# EAGLE design PCB-full (EAGLE 6.5.0)
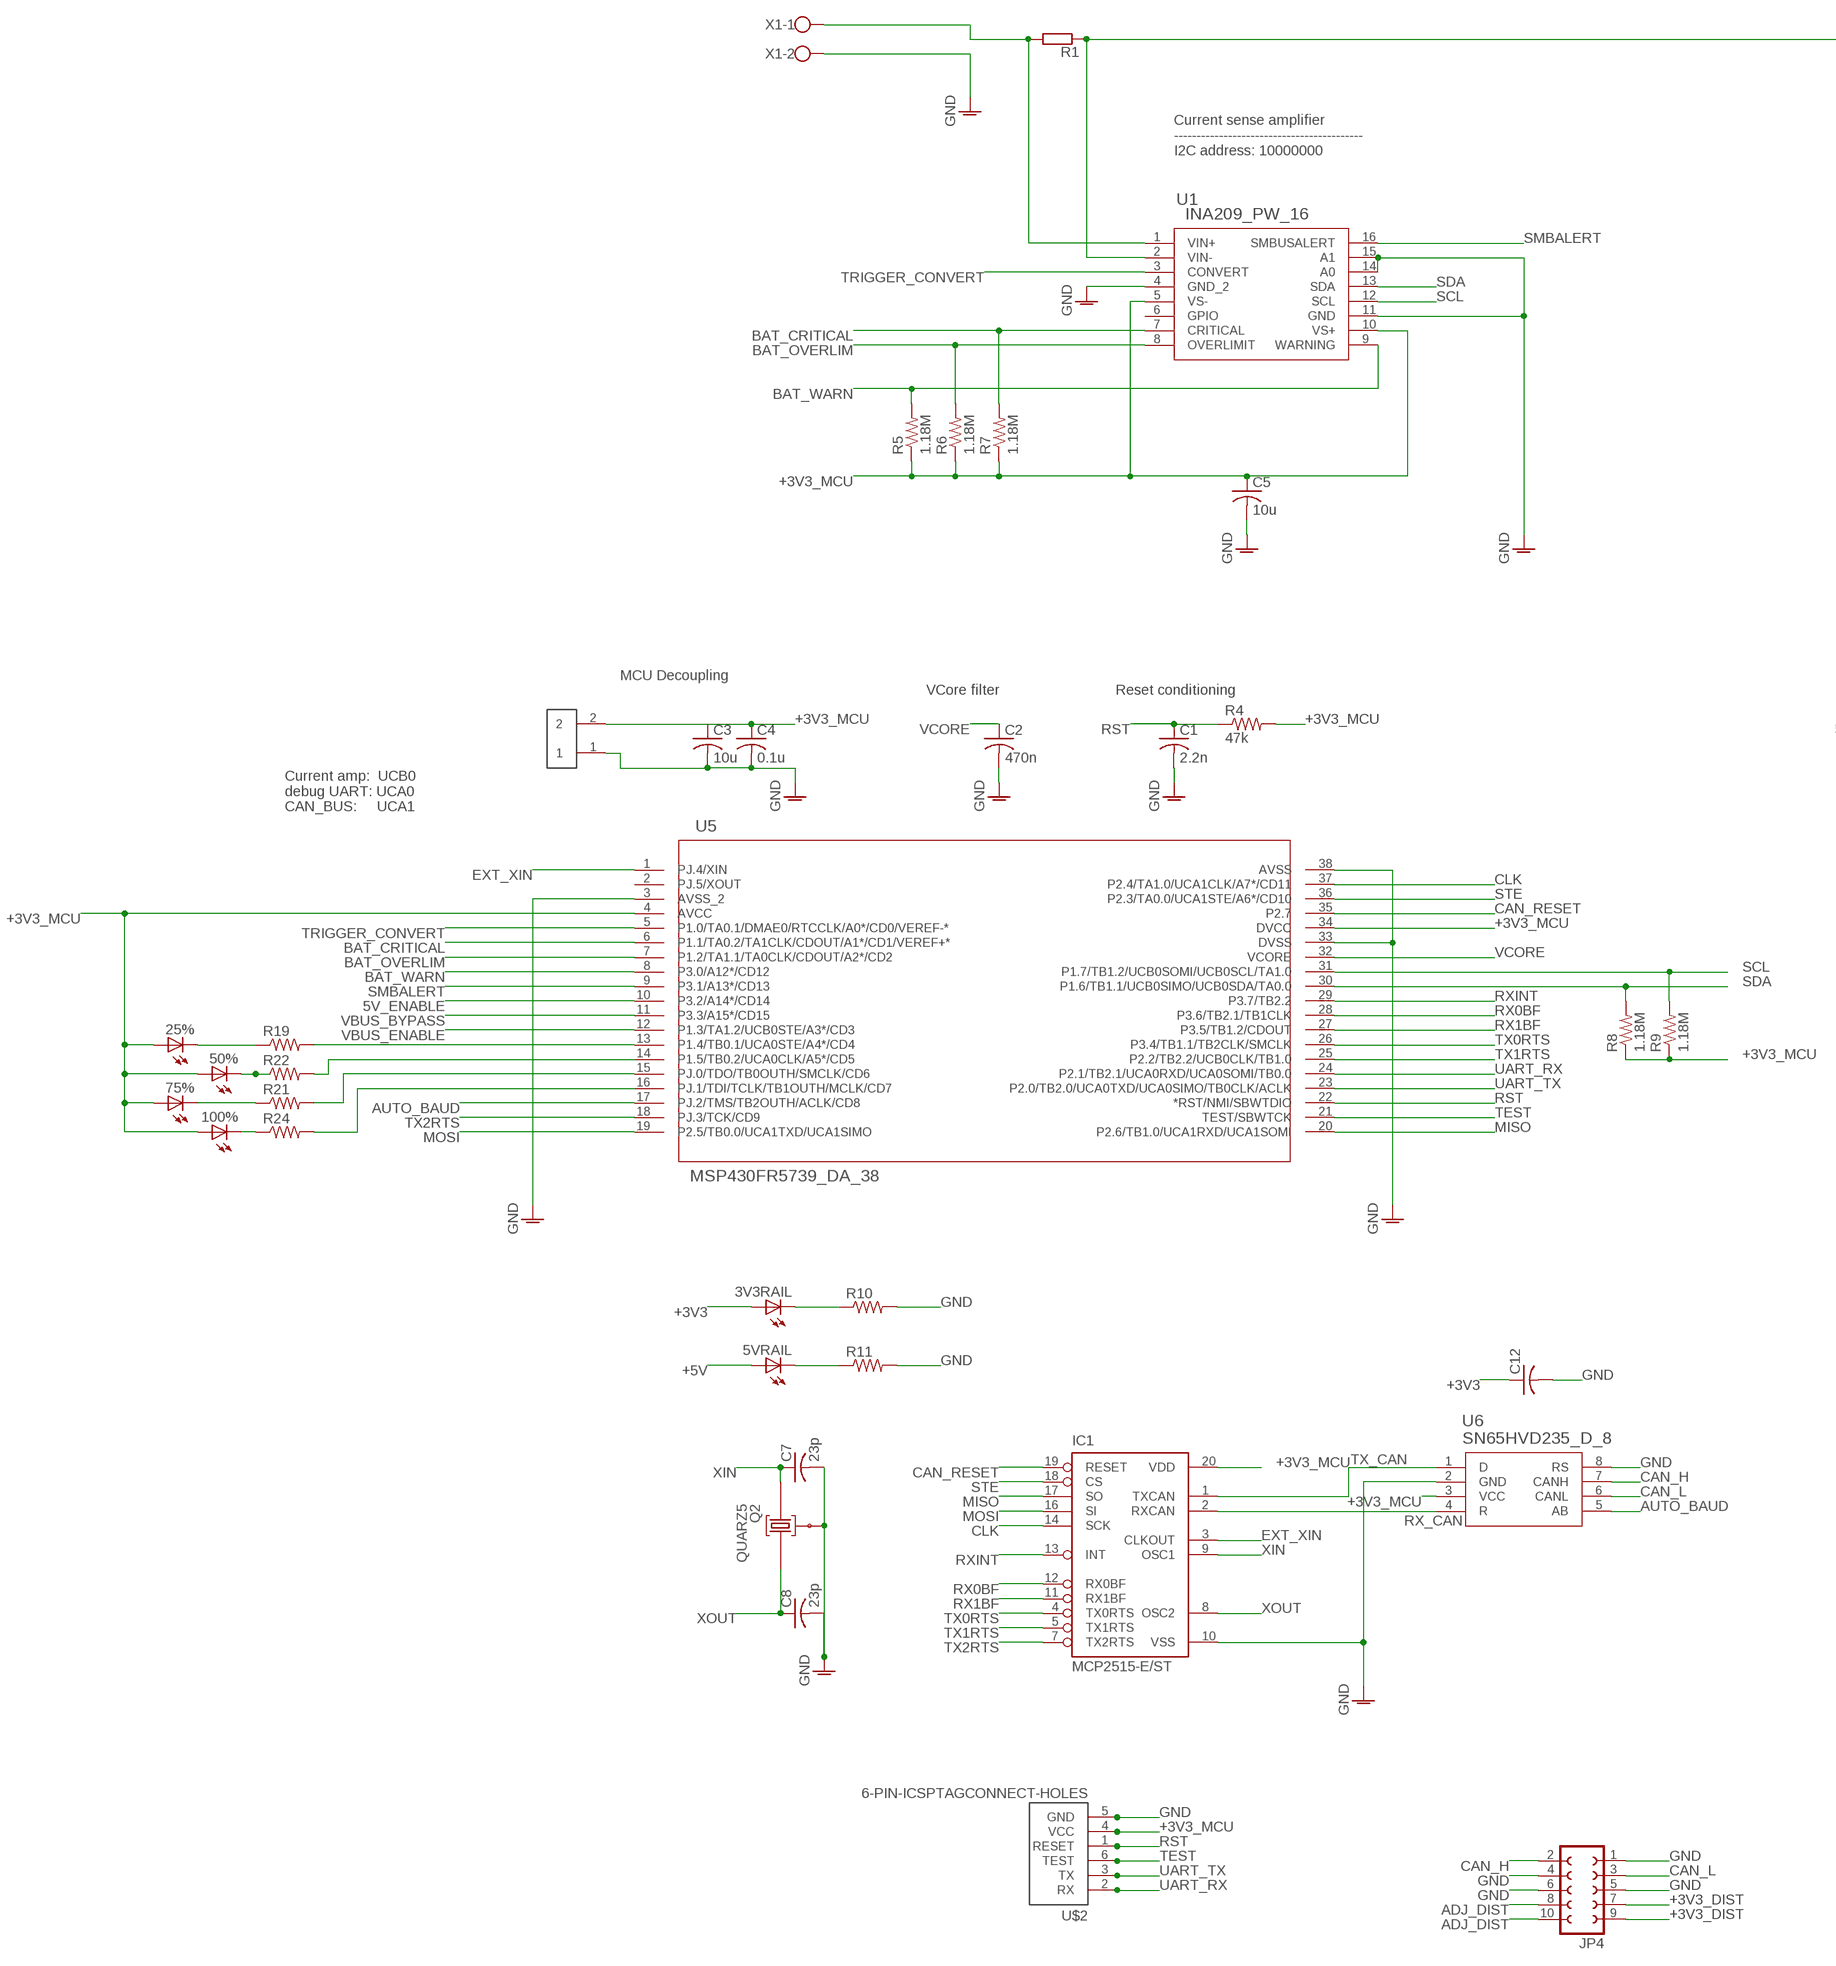
[diagram p0: schematic, sheet 1, part 1 of 2]
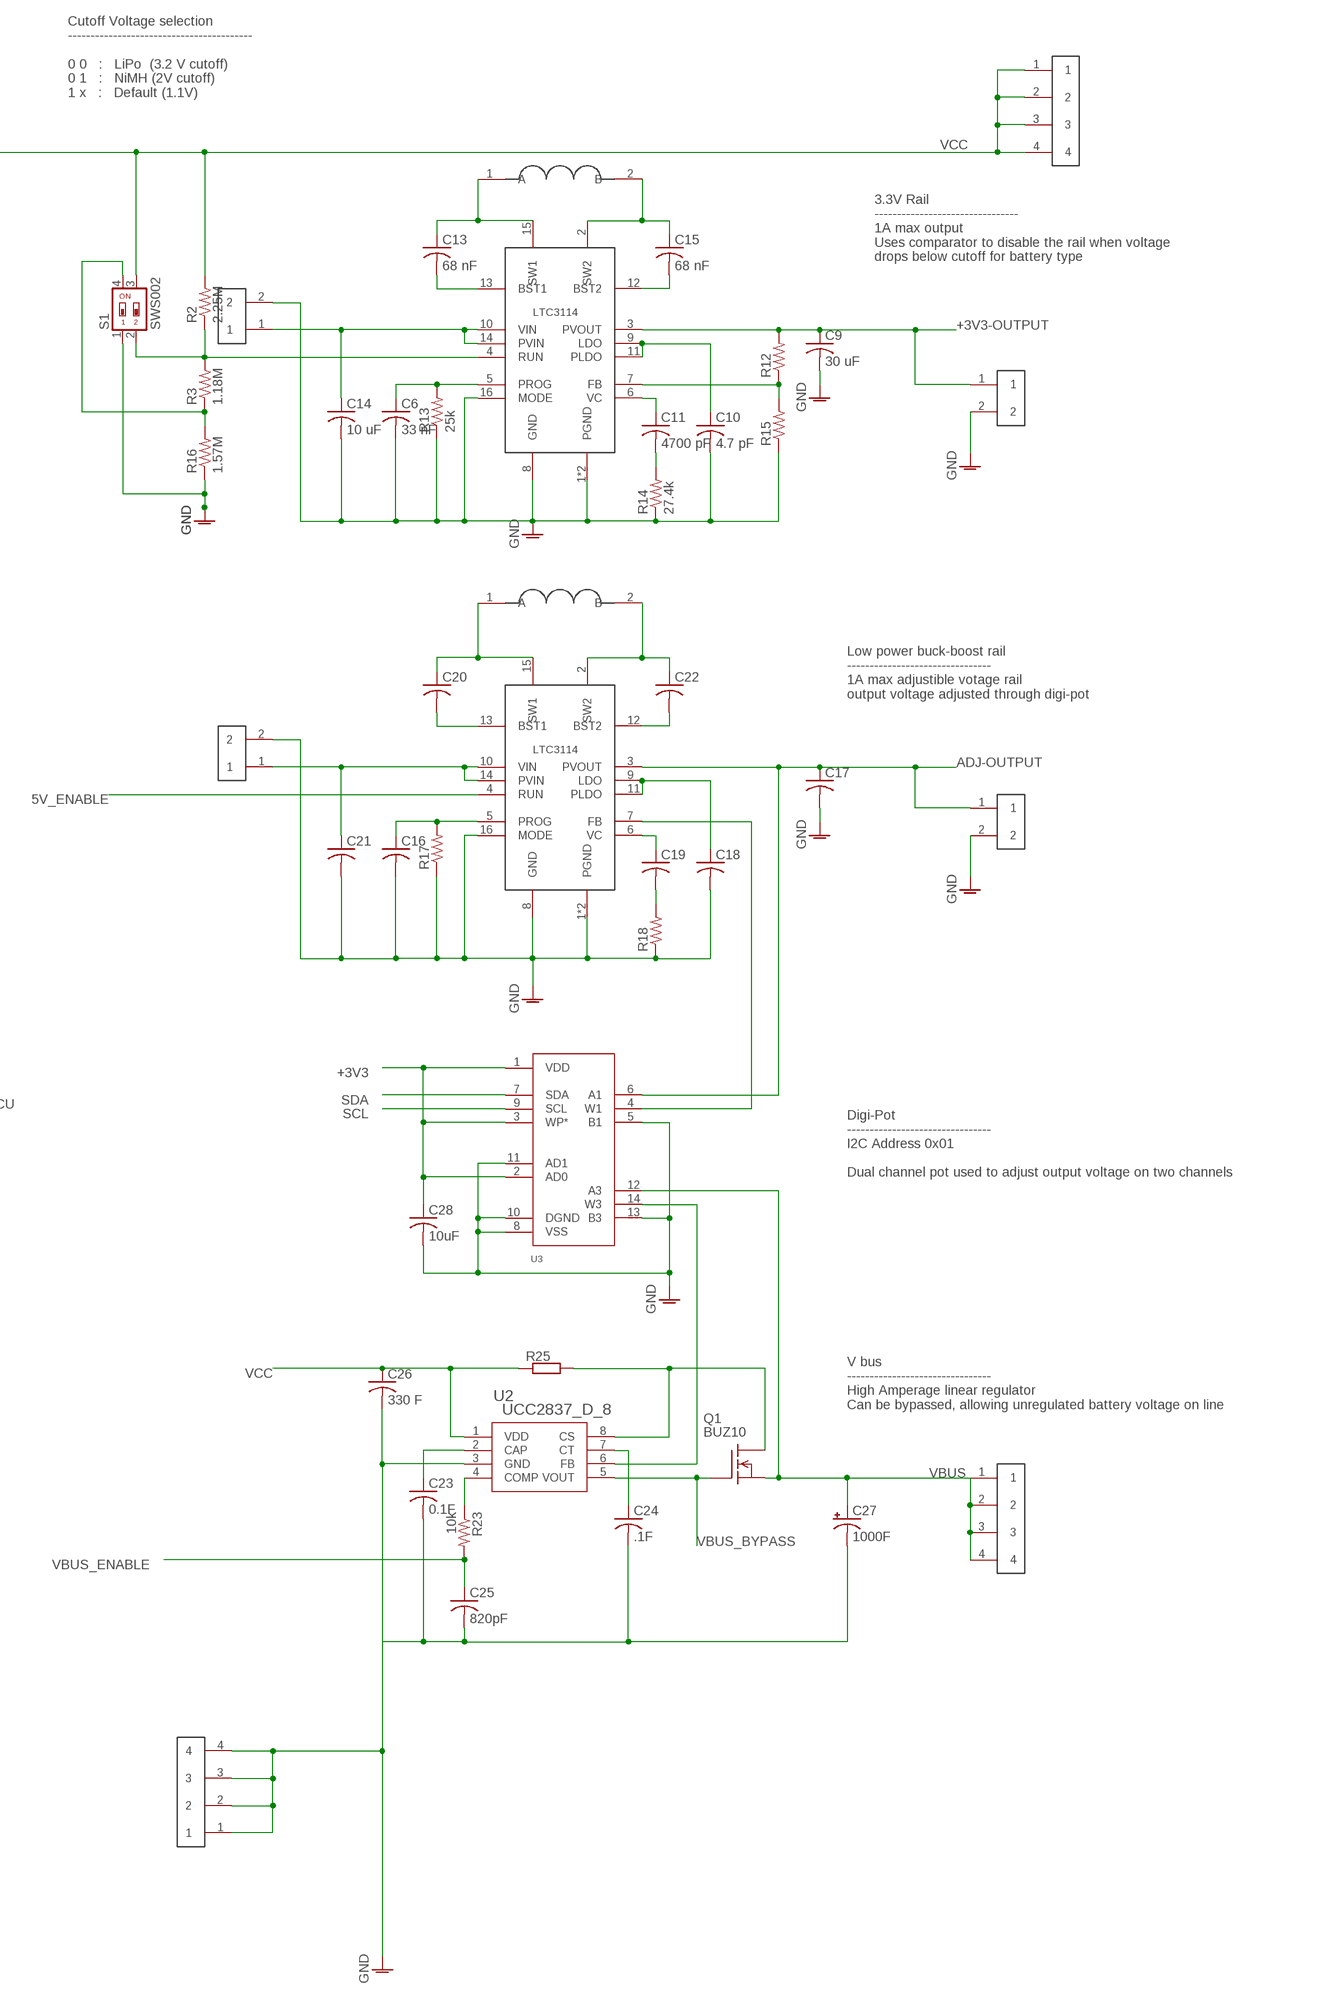
[diagram p1: schematic, sheet 1, part 2 of 2]

## Parts
3V3RAIL  LEDCHIP-LED0603  [CHIP-LED0603]
5VRAIL  LEDCHIP-LED0603  [CHIP-LED0603]
25%  LEDCHIP-LED0603  [CHIP-LED0603]
50%  LEDCHIP-LED0603  [CHIP-LED0603]
75%  LEDCHIP-LED0603  [CHIP-LED0603]
100%  LEDCHIP-LED0603  [CHIP-LED0603]
C1  2.2n  C-USC1206  [C1206]
C2  470n  C-USC1206  [C1206]
C3  10u  C-USC1206  [C1206]
C4  0.1u  C-USC1206  [C1206]
C5  10u  C-USC1206  [C1206]
C6  33 nF  C-USC0805  [C0805]
C7  23p  C-USC1206  [C1206]
C8  23p  C-USC1206  [C1206]
C9  30 uF  C-USC0805  [C0805]
C10  4.7 pF  C-USC0805  [C0805]
C11  4700 pF  C-USC0805  [C0805]
C12  C-USC0603  [C0603]
C13  68 nF  C-USC0805  [C0805]
C14  10 uF  C-USC0805  [C0805]
C15  68 nF  C-USC0805  [C0805]
C16  C-USC0805  [C0805]
C17  C-USC0805  [C0805]
C18  C-USC0805  [C0805]
C19  C-USC0805  [C0805]
C20  C-USC0805  [C0805]
C21  C-USC0805  [C0805]
C22  C-USC0805  [C0805]
C23  0.1F  C-USC0805  [C0805]
C24  .1F  C-USC0805  [C0805]
C25  820pF  C-USC0805  [C0805]
C26  330 F  C-USC0805  [C0805]
C27  1000F  CPOL-USTAP5-60  [TAP5-60]
C28  10uF  C-USC0603  [C0603]
IC1  MCP2515-E/ST  [TSSOP20]
JP4  FE05-2  [FE05-2]
Q1  BUZ10  [TO220]
Q2  QUARZ5  [QUARZ5]
R1  SMR  [SMR]
R2  2.25M  R-US_R0805  [R0805]
R3  1.18M  R-US_R0805  [R0805]
R4  47k  R-US_R1206  [R1206]
R5  1.18M  R-US_R0805  [R0805]
R6  1.18M  R-US_R0805  [R0805]
R7  1.18M  R-US_R0805  [R0805]
R8  1.18M  R-US_R0805  [R0805]
R9  1.18M  R-US_R0805  [R0805]
R10  R-US_R0603  [R0603]
R11  R-US_R0603  [R0603]
R12  R-US_M0805  [M0805]
R13  25k  R-US_M0805  [M0805]
R14  27.4k  R-US_M0805  [M0805]
R15  R-US_M0805  [M0805]
R16  1.57M  R-US_R0805  [R0805]
R17  R-US_M0805  [M0805]
R18  R-US_M0805  [M0805]
R19  R-US_R0603  [R0603]
R21  R-US_R0603  [R0603]
R22  R-US_R0603  [R0603]
R23  10k  R-US_M0805  [M0805]
R24  R-US_R0603  [R0603]
R25  SMR  [SMR]
S1  SWS002  [SMS-002]
U1  INA209_PW_16  [PW16]
U2  UCC2837_D_8  [D8]
U3  AD5252BRU10  [RU_14]
U5  MSP430FR5739_DA_38  [DA38]
U6  SN65HVD235_D_8  [D8]
U$1  LTC3114  [TSSOP-16]
U$2  6-PIN-ICSPTAGCONNECT-HOLES  [TAGCONNECT-HOLES]
U$3  LTC3114  [TSSOP-16]
U$4  DC630R-562M  [DC630]
U$5  DC630R-562M  [DC630]
U$6  1X2_HEADER  [1X2-.1HEADER]
U$7  1X2_HEADER  [1X2-.1HEADER]
U$8  1X2_HEADER  [1X2-.1HEADER]
U$9  1X2_HEADER  [1X2-.1HEADER]
U$10  1X2_HEADER  [1X2-.1HEADER]
U$11  1X4_HEADER  [1X4-.1HEADER]
U$12  1X4_HEADER  [1X4-.1HEADER]
U$14  1X4_HEADER  [1X4-.1HEADER]
X1  W237-102  [W237-102]

## Nets
5V_ENABLE: U5.10(P3.2/A14*/CD14) U$3.4(RUN)
+3V3: 3V3RAIL.A C12.1 C28.1 U3.1(VDD) U3.2(AD0) U3.3(WP*)
+3V3-OUTPUT: C9.1 R12.2 U$1.3(PVOUT) U$7.1
+3V3_DIST: JP4.7 JP4.9
+3V3_MCU: 25%.A 50%.A 75%.A 100%.A C3.1 C4.1 C5.1 IC1.20(VDD) R4.2 R5.1 R6.1 R7.1 R8.1 R9.1 U1.5(VS-) U1.10(VS+) U5.4(AVCC) U5.34(DVCC) U6.3(VCC) U$2.4(VCC) U$6.2
+5V: 5VRAIL.A
ADJ-OUTPUT: C17.1 U3.6(A1) U$3.3(PVOUT) U$8.1
ADJ_DIST: JP4.8 JP4.10
AUTO_BAUD: U5.17(PJ.2/TMS/TB2OUTH/ACLK/CD8) U6.5(AB)
BAT_CRITICAL: R7.2 U1.7(CRITICAL) U5.6(P1.1/TA0.2/TA1CLK/CDOUT/A1*/CD1/VEREF+*)
BAT_OVERLIM: R6.2 U1.8(OVERLIMIT) U5.7(P1.2/TA1.1/TA0CLK/CDOUT/A2*/CD2)
BAT_WARN: R5.2 U1.9(WARNING) U5.8(P3.0/A12*/CD12)
CAN_H: JP4.2 U6.7(CANH)
CAN_L: JP4.3 U6.6(CANL)
CAN_RESET: IC1.19(RESET) U5.35(P2.7)
CLK: IC1.14(SCK) U5.37(P2.4/TA1.0/UCA1CLK/A7*/CD11)
EXT_XIN: IC1.3(CLKOUT) U5.1(PJ.4/XIN)
GND: C1.2 C2.2 C3.2 C4.2 C5.2 C6.2 C7.2 C8.2 C10.2 C12.2 C14.2 C16.2 C17.2 C18.2 C21.2 C23.2 C24.2 C25.2 C26.2 C27.- C28.2 IC1.10(VSS) JP4.1 JP4.4 JP4.5 JP4.6 Q2.GND@0 R10.2 R11.2 R13.1 R14.1 R15.1 R16.1 R17.1 R18.1 S1.1 U1.4(GND_2) U1.11(GND) U1.14(A0) U1.15(A1) U2.3(GND) U3.5(B1) U3.8(VSS) U3.10(DGND) U3.11(AD1) U3.13(B3) U5.3(AVSS_2) U5.33(DVSS) U5.38(AVSS) U6.2(GND) U6.8(RS) U$1.1(PGND) U$1.8(GND) U$1.16(MODE) U$1.PAD(PGND) U$2.5(GND) U$3.1(PGND) U$3.8(GND) U$3.16(MODE) U$3.PAD(PGND) U$6.1 U$7.2 U$8.2 U$9.2 U$10.2 U$12.1 U$12.2 U$12.3 U$12.4 X1.2
GNDA: C9.2 ; supply symbol labelled GND
MISO: IC1.17(SO) U5.20(P2.6/TB1.0/UCA1RXD/UCA1SOMI)
MOSI: IC1.16(SI) U5.19(P2.5/TB0.0/UCA1TXD/UCA1SIMO)
N$1: 25%.C R19.1
N$2: R3.1 R16.2 S1.4
N$3: R19.2 U5.13(P1.4/TB0.1/UCA0STE/A4*/CD4)
N$4: 5VRAIL.C R11.1
N$5: 3V3RAIL.C R10.1
N$6: C13.1 U$1.15(SW1) U$4.1(A)
N$7: C15.1 U$1.2(SW2) U$4.2(B)
N$8: C13.2 U$1.13(BST1)
N$9: C15.2 U$1.12(BST2)
N$10: C20.1 U$3.15(SW1) U$5.1(A)
N$11: C6.1 R13.2 U$1.5(PROG)
N$12: C22.1 U$3.2(SW2) U$5.2(B)
N$13: C10.1 U$1.9(LDO) U$1.11(PLDO)
N$14: C20.2 U$3.13(BST1)
N$15: C11.1 U$1.6(VC)
N$16: C11.2 R14.2
N$17: R12.1 R15.2 U$1.7(FB)
N$18: C22.2 U$3.12(BST2)
N$19: C16.1 R17.2 U$3.5(PROG)
N$20: C18.1 U$3.9(LDO) U$3.11(PLDO)
N$21: R2.1 R3.2 S1.2 U$1.4(RUN)
N$22: C19.1 U$3.6(VC)
N$23: C19.2 R18.2
N$24: U3.4(W1) U$3.7(FB)
N$25: Q1.2(D) R25.1 U2.8(CS)
N$26: R22.2 U5.14(P1.5/TB0.2/UCA0CLK/A5*/CD5)
N$27: C23.1 U2.2(CAP)
N$28: U2.6(FB) U3.14(W3)
N$29: R23.1 U2.4(COMP)
N$30: R21.2 U5.15(PJ.0/TDO/TB0OUTH/SMCLK/CD6)
N$31: R24.2 U5.16(PJ.1/TDI/TCLK/TB1OUTH/MCLK/CD7)
N$32: C24.1 U2.7(CT)
N$33: 50%.C R22.1
N$34: 75%.C R21.1
N$35: 100%.C R24.1
RST: C1.1 R4.1 U5.22(*RST/NMI/SBWTDIO) U$2.1(RESET)
RX0BF: IC1.12(RX0BF) U5.28(P3.6/TB2.1/TB1CLK)
RX1BF: IC1.11(RX1BF) U5.27(P3.5/TB1.2/CDOUT)
RX_CAN: IC1.2(RXCAN) U6.4(R)
RXINT: IC1.13(INT) U5.29(P3.7/TB2.2)
SCL: R9.2 U1.12(SCL) U3.9(SCL) U5.31(P1.7/TB1.2/UCB0SOMI/UCB0SCL/TA1.0)
SDA: R8.2 U1.13(SDA) U3.7(SDA) U5.30(P1.6/TB1.1/UCB0SIMO/UCB0SDA/TA0.0)
SMBALERT: U1.16(SMBUSALERT) U5.9(P3.1/A13*/CD13)
STE: IC1.18(CS) U5.36(P2.3/TA0.0/UCA1STE/A6*/CD10)
TEST: U5.21(TEST/SBWTCK) U$2.6(TEST)
TRIGGER_CONVERT: U1.3(CONVERT) U5.5(P1.0/TA0.1/DMAE0/RTCCLK/A0*/CD0/VEREF-*)
TX0RTS: IC1.4(TX0RTS) U5.26(P3.4/TB1.1/TB2CLK/SMCLK)
TX1RTS: IC1.5(TX1RTS) U5.25(P2.2/TB2.2/UCB0CLK/TB1.0)
TX2RTS: IC1.7(TX2RTS) U5.18(PJ.3/TCK/CD9)
TX_CAN: IC1.1(TXCAN) U6.1(D)
UART_RX: U5.24(P2.1/TB2.1/UCA0RXD/UCA0SOMI/TB0.0) U$2.2(RX)
UART_TX: U5.23(P2.0/TB2.0/UCA0TXD/UCA0SIMO/TB0CLK/ACLK) U$2.3(TX)
VBUS: C27.+ Q1.3(S) U3.12(A3) U$14.1 U$14.2 U$14.3 U$14.4
VBUS_BYPASS: Q1.1(G) U2.5(VOUT) U5.11(P3.3/A15*/CD15)
VBUS_ENABLE: C25.1 R23.2 U5.12(P1.3/TA1.2/UCB0STE/A3*/CD3)
VCC: C26.1 R1.2 R2.2 R25.2 S1.3 U1.2(VIN-) U2.1(VDD) U$11.1 U$11.2 U$11.3 U$11.4
VCC_1: R1.1 U1.1(VIN+) X1.1
VCC_3V: C14.1 U$1.10(VIN) U$1.14(PVIN) U$9.1
VCC_ADJ: C21.1 U$3.10(VIN) U$3.14(PVIN) U$10.1
VCORE: C2.1 U5.32(VCORE)
XIN: C7.1 IC1.9(OSC1) Q2.2
XOUT: C8.1 IC1.8(OSC2) Q2.1
Unconnected: U1.6(GPIO) U5.2(PJ.5/XOUT)

## Notes on the sheet
- Cutoff Voltage selection
  -----------------------------------------
  
  0 0   :   LiPo  (3.2 V cutoff)
  0 1   :   NiMH (2V cutoff)
  1 x   :   Default (1.1V)
- Current sense amplifier
  ------------------------------------------
  I2C address: 10000000
- 3.3V Rail
  --------------------------------
  1A max output
  Uses comparator to disable the rail when voltage
  drops below cutoff for battery type
- Low power buck-boost rail
  --------------------------------
  1A max adjustible votage rail
  output voltage adjusted through digi-pot
- MCU Decoupling
- VCore filter | Reset conditioning
- Current amp:  UCB0
  debug UART: UCA0
  CAN_BUS:     UCA1
- Digi-Pot
  --------------------------------
  I2C Address 0x01
  
  Dual channel pot used to adjust output voltage on two channels
- V bus
  --------------------------------
  High Amperage linear regulator
  Can be bypassed, allowing unregulated battery voltage on line

## Library data of the parts
3V3RAIL 5VRAIL 25% 50% 75% 100% = adafruit:LED: LED OSRAM: - CHIPLED LG R971, LG N971, LY N971, LG Q971, LY Q971, LO R971, LY R971 LH N974, LH R974 LS Q976, LO Q976, LY Q976 LO Q996 - Hyper CHIPLED LW Q18S LB Q993, LB Q99A, LB R99A - SideLED LS A670, LO A670, LY A670, LG A670, LP A670 LB A673, LV A673, LT A673, LW A673 LH A674 LY A675 LS A676, LA A676, LO A676, LY A676, LW A676 LS A679, LY A679, LG A679 - Hyper Micro SIDELED® LS Y876, LA Y876, LO Y876, LY Y876 LT Y87S - SmartLED LW L88C, LW L88S LB L89C, LB L89S, LG L890 LS L89K, LO L89K, LY L89K LS L896, LA L896, LO L896, LY L896 - TOPLED LS T670, LO T670, LY T670, LG T670, LP T670 LSG T670, LSP T670, LSY T670, LOP T670, LYG T670 LG T671, LOG T671, LSG T671 LB T673, LV T673, LT T673, LW T673 LH T674 LS T676, LA T676, LO T676, LY T676, LB T676, LH T676, LSB T676, LW T676 LB T67C, LV T67C, LT T67C, LS T67K, LO T67K, LY T67K, LW E67C LS E67B, LA E67B, LO E67B, LY E67B, LB E67C, LV E67C, LT E67C LW T67C LS T679, LY T679, LG T679 LS T770, LO T770, LY T770, LG T770, LP T770 LB T773, LV T773, LT T773, LW T773 LH T774 LS E675, LA E675, LY E675, LS T675 LS T776, LA T776, LO T776, LY T776, LB T776 LHGB T686 LT T68C, LB T68C - Hyper Mini TOPLED® LB M676 - Mini TOPLED Santana® LG M470 LS M47K, LO M47K, LY M47K Source: http://www.osram.convergy.de/
C1-C26 C28 = adafruit:C-US: CAPACITOR, American symbol
C27 = resistor:CPOL-US: POLARIZED CAPACITOR, American symbol
IC1 = mcp2515:MCP2515
JP4 = con-lsta:FE05-2: FEMALE HEADER; OC_FARNELL: unknown; OC_NEWARK: unknown
Q1 = transistor-fet:BUZ10: N-Channel Enhancement MOSFET 50V; 20A; 0,080Ohm
Q2 = sMSP430:QUARZ5
R1 R25 = resistor-shunt:SMR: SMD SHUNT RESISTOR; OC_FARNELL: unknown; OC_NEWARK: unknown
R2-R19 R21-R24 = adafruit:R-US_: RESISTOR, American symbol
S1 = smd-special:SWS002: SMD Dip Switch 2 pol.
U1 = TexasInstruments:INA209_PW_16; DATASHEETURL: http://www.ti.com/lit/gpn/INA209; DESCRIPTION: High-Side Measurement, Bi-Directional Current/Power Monitor with I2C Interface; FAMILY_NAME: CURRENT SHUNT MONITOR; GENERIC_PART_NUMBER: INA209; INDUSTRY_STD_PKG_TYPE: TSSOP; MANUFACTURER: Texas Instruments; MANUFACTURER_PART_NUMBER: ina209_pw_16; PACKAGE_DESIGNATOR: PW; PIN_COUNT: 16; VENDOR: Texas Instruments
U2 = TexasInstruments:UCC2837_D_8; DATASHEETURL: http://www.ti.com/lit/gpn/UCC2837; DESCRIPTION: 8-Pin N-FET Linear Regulator Controller; FAMILY_NAME: LDO CONTROLLER; GENERIC_PART_NUMBER: UCC2837; INDUSTRY_STD_PKG_TYPE: SOIC; MANUFACTURER: Texas Instruments; MANUFACTURER_PART_NUMBER: ucc2837_d_8; PACKAGE_DESIGNATOR: D; PIN_COUNT: 8; VENDOR: Texas Instruments
U3 = linear:AD5252BRU10; MANUFACTURER_PART_NUMBER: AD5252BRU10; VENDOR: Vendor
U5 = TexasInstruments:MSP430FR5739_DA_38; DATASHEETURL: http://www.ti.com/lit/gpn/MSP430FR5739; DESCRIPTION: MSP430FR573x,MSP430FR572x Mixed Signal Microcontroller; FAMILY_NAME: FRAM Series; GENERIC_PART_NUMBER: MSP430FR5739; INDUSTRY_STD_PKG_TYPE: TSSOP; MANUFACTURER: Texas Instruments; MANUFACTURER_PART_NUMBER: msp430fr5739_da_38; PACKAGE_DESIGNATOR: DA; PIN_COUNT: 38; VENDOR: Texas Instruments
U6 = TexasInstruments:SN65HVD235_D_8; DATASHEETURL: http://www.ti.com/lit/gpn/SN65HVD235; DESCRIPTION: 3.3V CAN with Standby Mode, Autobaud Loop-back; FAMILY_NAME: CAN; GENERIC_PART_NUMBER: SN65HVD235; INDUSTRY_STD_PKG_TYPE: SOIC; MANUFACTURER: Texas Instruments; MANUFACTURER_PART_NUMBER: sn65hvd235_d_8; PACKAGE_DESIGNATOR: D; PIN_COUNT: 8; VENDOR: Texas Instruments
U$1 U$3 = linear:LTC3114
U$2 = LaunchFET:6-PIN-ICSP: 6 pin easy-msp formatted headers. Designed to make programming target boards with MSP430 Launchpad easier. EASYMSP: standard .05" pitch header to match launchpad SAFEMSP: .05" header with .025" offset Vcc to keep Geordi away
U$4 U$5 = connectors:DC630R-562M
U$6-U$10 = connectors:1X2_HEADER
U$11 U$12 U$14 = connectors:1X4_HEADER
X1 = con-wago-500:W237-102: WAGO SCREW CLAMP; MPN: 237-102; OC_FARNELL: unknown; OC_NEWARK: 70K9898

## Board
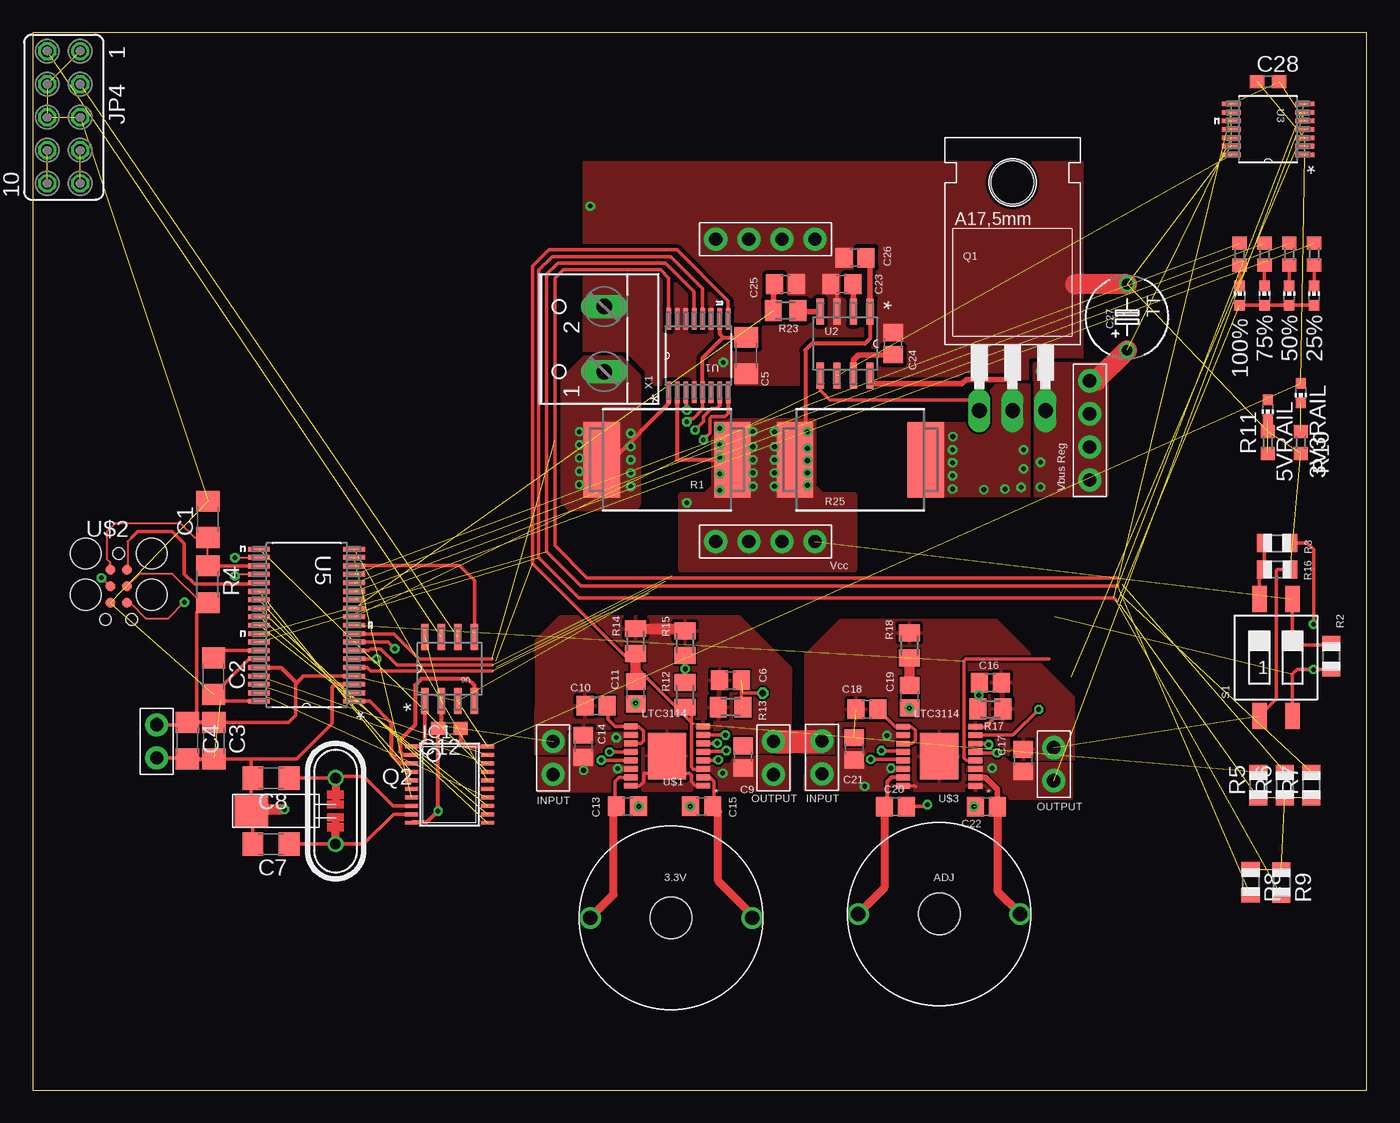
[diagram p2: board, top side]
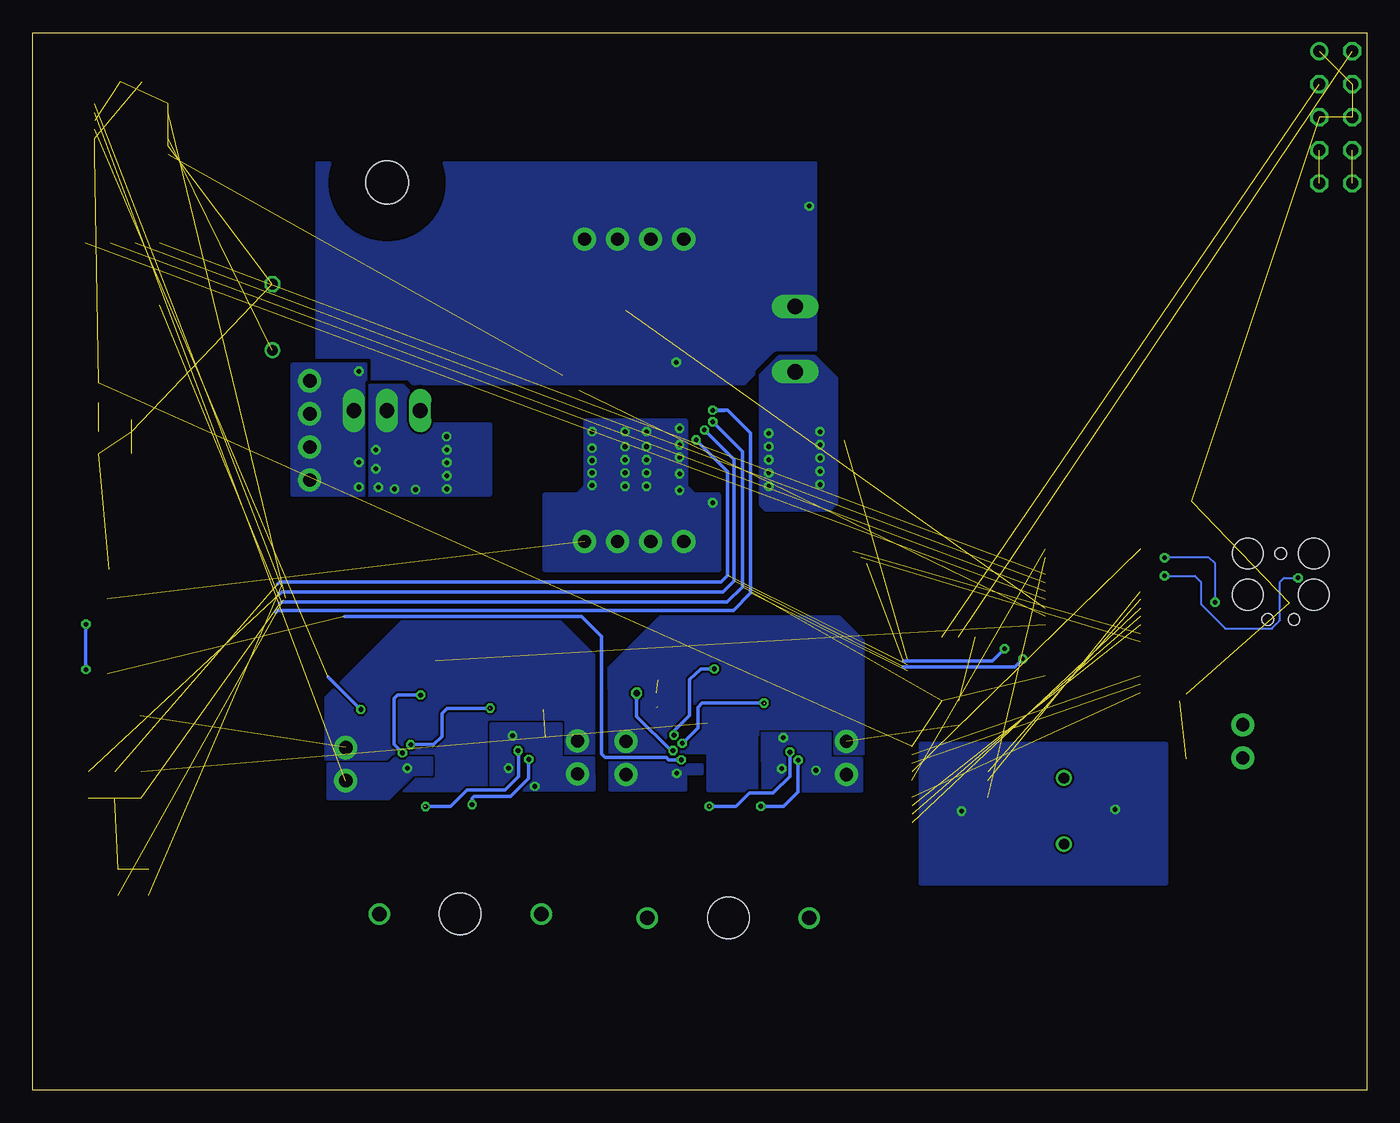
[diagram p3: board, bottom side, seen from below]

Size 102.54 x 81.27 mm. Coordinates in mm from the lower left corner, seen from the top.
Outline: 0,0 102.54,0 102.54,81.27 0,81.27 0,0
Copper layers (1*16): Top 0.0356mm / dielectric 1.5011mm / Bottom 0.0356mm
Design rules "oshpark": minimum track width 6mil, minimum drill 13mil, track to track 6mil, track to pad 6mil, pad to pad 6mil, via to via 6mil, smd to smd 6mil, copper to edge 15mil, drill to drill 6mil, minimum pad ring 7mil, minimum via ring 7mil, stop-mask expansion 4mil, vias tented up to drill 0mil, thermal gap 10mil

### Footprints (pad centres in the part's own frame; a part is rotated, then mirrored left to right if it is on the bottom)
CHIP-LED0603 = smd 0.8 x 0.8: A 0,-0.75; C 0,0.75
C1206 = smd 1.6 x 1.8: 1 -1.4,0; 2 1.4,0
C0805 = smd 1.3 x 1.5: 1 -0.85,0; 2 0.85,0
C0603 = smd 1.1 x 1: 1 -0.85,0; 2 0.85,0
TAP5-60 = drill 0.813: + -2.54,0 | drill 0.813 octagon: - 2.54,0
TSSOP20 = smd 0.305 x 0.991: 1 -2.925,-2.918; 2 -2.275,-2.918; 3 -1.625,-2.918; 4 -0.975,-2.918; 5 -0.325,-2.918; 6 0.325,-2.918; 7 0.975,-2.918; 8 1.625,-2.918; 9 2.275,-2.918; 10 2.925,-2.918; 11 2.925,2.918; 12 2.275,2.918; 13 1.625,2.918; 14 0.975,2.918; 15 0.325,2.918; 16 -0.325,2.918; 17 -0.975,2.918; 18 -1.625,2.918; 19 -2.275,2.918; 20 -2.925,2.918
FE05-2 = drill 0.914: 1 -5.08,1.27 | drill 0.914 octagon: 2 -5.08,-1.27; 3 -2.54,1.27; 4 -2.54,-1.27; 5 0,1.27; 6 0,-1.27; 7 2.54,1.27; 8 2.54,-1.27; 9 5.08,1.27; 10 5.08,-1.27
TO220 = drill 1.118 long: 1 -2.54,-6.35; 2 0,-6.35; 3 2.54,-6.35 | hole 3.302: 0,11.176
QUARZ5 = drill 0.813: 1 1.53,1.773; 2 1.52,-3.303 | smd 2.54 x 2.54: GND@0 -4.941,-0.762
SMR = smd 2.8 x 5.8: 1 5.029,0; 2 -5.029,0
R0805 = smd 1.1 x 1.4: 1 -1,0; 2 1,0
R1206 = smd 1.6 x 1.803: 1 -1.422,0; 2 1.422,0
R0603 = smd 1 x 1.1: 1 -0.85,0; 2 0.85,0
M0805 = smd 1.3 x 1.6: 1 -0.95,0; 2 0.95,0
SMS-002 = smd 1.092 x 2.007: 1 -1.27,-4.496; 2 1.27,-4.496; 3 1.27,4.496; 4 -1.27,4.496
PW16 = smd 1.676 x 0.356: 1 -2.819,2.286; 2 -2.819,1.626; 3 -2.819,0.965; 4 -2.819,0.33; 5 -2.819,-0.33; 6 -2.819,-0.965; 7 -2.819,-1.626; 8 -2.819,-2.286; 9 2.819,-2.286; 10 2.819,-1.626; 11 2.819,-0.965; 12 2.819,-0.33; 13 2.819,0.33; 14 2.819,0.965; 15 2.819,1.626; 16 2.819,2.286
D8 = smd 1.981 x 0.559: 1 -2.464,1.905; 2 -2.464,0.635; 3 -2.464,-0.635; 4 -2.464,-1.905; 5 2.464,-1.905; 6 2.464,-0.635; 7 2.464,0.635; 8 2.464,1.905
RU_14 = smd 1.473 x 0.356: 1 -2.819,1.956; 2 -2.819,1.295; 3 -2.819,0.66; 4 -2.819,0; 5 -2.819,-0.66; 6 -2.819,-1.295; 7 -2.819,-1.956; 8 2.819,-1.956; 9 2.819,-1.295; 10 2.819,-0.66; 11 2.819,0; 12 2.819,0.66; 13 2.819,1.295; 14 2.819,1.956
DA38 = smd 1.676 x 0.356: 1 -3.658,5.842; 2 -3.658,5.207; 3 -3.658,4.547; 4 -3.658,3.912; 5 -3.658,3.251; 6 -3.658,2.591; 7 -3.658,1.956; 8 -3.658,1.295; 9 -3.658,0.66; 10 -3.658,0; 11 -3.658,-0.66; 12 -3.658,-1.295; 13 -3.658,-1.956; 14 -3.658,-2.591; 15 -3.658,-3.251; 16 -3.658,-3.912; 17 -3.658,-4.547; 18 -3.658,-5.207; 19 -3.658,-5.842; 20 3.658,-5.842; 21 3.658,-5.207; 22 3.658,-4.547; 23 3.658,-3.912; 24 3.658,-3.251; 25 3.658,-2.591; 26 3.658,-1.956; 27 3.658,-1.295; 28 3.658,-0.66; 29 3.658,0; 30 3.658,0.66; 31 3.658,1.295; 32 3.658,1.956; 33 3.658,2.591; 34 3.658,3.251; 35 3.658,3.912; 36 3.658,4.547; 37 3.658,5.207; 38 3.658,5.842
TSSOP-16 = smd 0.45 x 1.05: 1 0,0.525; 2 0.65,0.525; 3 1.3,0.525; 4 1.95,0.525; 5 2.6,0.525; 6 3.25,0.525; 7 3.9,0.525; 8 4.55,0.525; 9 4.55,6.075; 10 3.9,6.075; 11 3.25,6.075; 12 2.6,6.075; 13 1.95,6.075; 14 1.3,6.075; 15 0.65,6.075; 16 0,6.075 | smd 3.58 x 2.94: PAD 2.275,3.3
TAGCONNECT-HOLES = smd 0.787 x 0.787: 1 -1.27,-0.635; 2 -1.27,0.635; 3 0,-0.635; 4 0,0.635; 5 1.27,-0.635; 6 1.27,0.635 | hole 0.889: -2.54,0; 2.54,-1.016; 2.54,1.016 | hole 2.375: -2.54,2.54; -2.54,-2.54; 0.635,-2.54; 0.635,2.54
DC630 = drill 1.1: 1 0,-6.35; 2 0,6.096 | hole 3.2: 0,-0.127
1X2-.1HEADER = drill 1.016 pad 1.778: 1 -2.54,0; 2 0,0
1X4-.1HEADER = drill 1.016 pad 1.778: 1 -5.08,0; 2 -2.54,0; 3 0,0; 4 2.54,0
W237-102 = drill 1.194 long: 1 -2.5,-1.27; 2 2.5,-1.27

### Placement (x,y rotation side)
3V3RAIL  97.46,53.57 180 top
5VRAIL  94.92,52.3 180 top
25%  98.47,61.06 0 top
50%  96.57,61.06 0 top
75%  94.66,61.06 0 top
100%  92.76,61.06 0 top
C1  13.48,43.85 90 top
C2  13.92,31.8 270 top
C3  13.92,26.85 270 top
C4  11.89,26.85 270 top
C5  54.85,56.44 270 top
C6  53.64,31.49 180 top
C7  18.33,18.9 180 top
C8  18.33,23.98 180 top
C9  54.59,25.61 90 top
C10  43.31,29.53 180 top
C11  46.34,30.53 90 top
C12  32.05,27.79 180 top
C13  45.7,21.8 0 top
C14  42.34,26.42 90 top
C15  51.42,21.8 180 top
C16  73.61,31.31 0 top
C17  76.12,25.33 90 top
C18  64.12,29.26 180 top
C19  67.39,30.23 90 top
C20  66.31,21.79 0 top
C21  63.13,26.23 90 top
C22  73.29,21.79 180 top
C23  62.19,61.93 180 top
C24  66.12,57.36 90 top
C25  57.87,61.93 0 top
C26  63.2,63.97 180 top
C27  84.11,59.39 90 top
C28  94.95,77.48 0 top
IC1  32.05,23.48 270 top
JP4  2.4,74.76 270 top
Q1  75.3,58.57 0 top
Q2  21.76,22.21 0 top
R1  48.76,48.44 180 top
R2  99.8,33.33 90 top
R3  95.64,42.03 0 top
R4  13.46,38.87 270 top
R5  94.2,23.43 90 top
R6  96.23,23.43 90 top
R7  98.26,23.43 90 top
R8  93.6,15.97 270 top
R9  95.96,15.95 270 top
R10  97.46,49.76 270 top
R11  94.92,49.76 90 top
R12  50.15,30.38 270 top
R13  53.64,29.42 0 top
R14  46.34,34.5 270 top
R15  50.15,34.34 270 top
R16  95.64,40 180 top
R17  73.61,29.28 180 top
R18  67.39,34.17 270 top
R19  98.47,64.23 90 top
R21  94.66,64.23 90 top
R22  96.57,64.23 90 top
R23  57.87,59.9 180 top
R24  92.76,64.23 90 top
R25  63.61,48.44 0 top
S1  95.55,33.24 0 top
U1  51.17,56.44 90 top
U2  62.44,57.36 270 top
U3  94.95,73.83 180 top
U5  21.06,35.73 180 top
U6  32.05,32.37 90 top
U$1  52.05,23.39 90 top
U$2  6.62,38.7 270 top
U$3  72.97,23.37 90 top
U$4  49.2,13.23 270 top
U$5  69.8,13.53 270 top
U$6  9.53,28.07 90 top
U$7  56.94,26.79 90 top
U$8  78.47,26.32 90 top
U$9  39.99,26.79 90 top
U$10  60.66,26.84 90 top
U$11  57.58,42.15 0 top
U$12  57.58,65.4 0 top
U$14  81.24,51.97 90 top
X1  42.66,57.71 90 top

### Tracks (layer width: path | path; a pad name or v marks a point on that pad's centre or on a via)
5V_ENABLE  (1 unrouted)
  Top 0.254: U$3.4 71.75,25.32 71.56,25.51 71.56,32.98 71.72,33.14 78.1,33.14
+3V3  (5 unrouted)
  Top 0.305: C12.1 32.9,26.82 33.31,26.4 34.96,26.4
+3V3-OUTPUT  (via drill 0.36)
  Top 0.254: 54.52,24.69 C9.1 | 50.62,28.95 50.62,24.82 50.78,24.66 51.5,24.66 U$1.3
  Top 0.305: R12.2 50.62,28.95
  other vias: 53.04,24.34
  pour Top (rank 5, no thermals): 51.1,24.34 51.1,24.98 53.64,24.98 53.96,25.64 58.18,25.61 58.18,23.07 52.37,23.07 52.05,24.34
  pour Bottom (rank 5, no thermals): 51.1,24.34 51.1,24.98 53.64,24.98 53.96,25.64 58.18,25.61 58.18,23.07 52.37,23.07 52.37,24.34
+3V3_DIST  (1 unrouted)
+3V3_MCU  (via drill 0.36)  (9 unrouted)
  Top 0.152: R4.2 12.95,37.45 10.73,39.67 8.22,39.67 U$2.4
  Top 0.254: 100%.A 75%.A 50%.A 25%.A | U$6.2 11.72,28.07 C4.1 | U5.4 20.83,31.82 | U1.5 51.5,52.33 50.79,51.62 50.53,51.62 v50.28,51.36 | C3.1 19.69,28.25 20.23,28.78 20.23,31.21 20.3,31.28 | R4.2 13.34,37.45 12.6,36.72 12.6,28.4 12.45,28.25
  Top 0.305: C3.1 12.45,28.25 C4.1 | 20.83,31.82 20.3,31.28 19.1,32.48 U5.34 | U1.10 52.79,58.12 53.07,57.84 | 53.07,57.84 C5.1 | U1.5 51.5,56.26 53.07,57.84
  Bottom 0.254: v50.28,51.36 47.99,49.08 47.99,38.66 49.16,37.49 83.39,37.49 83.54,37.34
ADJ-OUTPUT  (via drill 0.36)  (1 unrouted)
  other vias: 73.74,24.74
  pour Top (no thermals): 71.88,24.27 73.28,24.27 75.14,22.4 79.81,22.4 79.81,25.05 75.14,25.05 74.68,25.51 71.88,25.51
  pour Bottom (no thermals): 71.88,24.27 73.28,24.27 75.14,22.4 79.81,22.4 79.81,25.05 75.14,25.05 74.68,25.51 71.88,25.51
ADJ_DIST  (1 unrouted)
AUTO_BAUD
  Top 0.254: U6.5 33.95,39.17 32.83,40.29 24.73,40.29 U5.17
BAT_CRITICAL  (via drill 0.36)  (2 unrouted)
  Top 0.254: v50.91,50.73 51.55,51.36 51.55,51.74 52.18,52.38 52.56,52.38 52.79,52.61 | U5.6 24.74,33.14 v26.45,33.14
  Top 0.305: U1.7 52.79,52.61
  Bottom 0.254: v50.91,50.73 48.63,48.44 48.63,39.12 49.47,38.27 83.39,38.27 83.54,38.12 | v26.45,33.14 27.07,32.52 35.63,32.52
BAT_OVERLIM  (via drill 0.36)  (2 unrouted)
  Top 0.254: 53.45,52.38 53.45,52 53.2,51.74 52.18,51.74 52.06,51.62 52.06,50.47 v51.55,49.97 | U5.7 25.84,33.77 25.98,33.91 26.76,33.91 28,32.67 35.32,32.67
  Top 0.305: U1.8 53.45,52.38
  Bottom 0.254: v51.55,49.97 49.14,47.55 49.14,39.54 49.63,39.05 83.54,39.05 83.7,38.89
BAT_WARN  (via drill 0.36)  (2 unrouted)
  Top 0.254: U1.9 53.45,60.63 49.52,64.57 39.68,64.57 38.43,63.32 38.43,40.45 50.72,28.16 | U5.8 27.33,34.43 v27.85,33.91
  Bottom 0.254: v27.85,33.91 28.78,32.98 35.63,32.98
CAN_H  (1 unrouted)
CAN_L  (1 unrouted)
CAN_RESET  (1 unrouted)
CLK  (1 unrouted)
EXT_XIN
  Top 0.254: U5.1 25.89,29.89 27.6,28.18
  Top 0.305: IC1.3 28.26,25.1 27.6,25.76 27.6,28.18
GND  (via drill 0.36)  (20 unrouted)
  Top 0.254: U$1.16 46.66,23.39 46.97,23.71 46.97,24.34 47.43,24.34 U$1.PAD | U$1.1 50.94,23.39 50.62,23.71 50.62,24.18 50.47,24.34 50.15,24.34 | C7.2 16.93,21.33 Q2.GND@0 16.82,23.87 | 16.82,23.87 C8.2 | U2.3 61.8,61.47 C23.2 | R16.1 95.64,40 95.58,39.94 95.58,30.04 S1.1 | U$3.8 73.2,27.92 R17.1 | U$3.16 67.79,23.37 67.83,23.34 | U$6.1 11.8,25.53 C4.2 | C3.2 16.65,25.45 | 16.65,25.45 20.31,25.45 23.02,28.16 23.02,30.96 23.09,31.03 | 16.82,23.87 16.82,25.28 16.65,25.45 | U5.38 14.43,29.89 C2.2 16.66,33.14 U5.33
  Top 0.305: C4.2 C3.2 | U5.3 23.24,31.18 23.09,31.03 | U6.2 31.41,28.01 C12.2 31.16,27.75 v31.16,21.44 30.27,20.55 IC1.10
  Top 0.813: 50.31,35.45 R15.1 49.99,35.45 R14.1 | v19.34,21.57 16.94,21.57 Q2.GND@0
  Top 1.524: C27.- 80.14,61.94 80.12,61.92
  Top 1.778: U$7.2 60.61,26.79 U$10.2
  other vias: 53.07,55.93 42.85,67.94
  pour Bottom (isolate 0.305, rank 3, no thermals): 42.41,56.7 45.45,56.7 47.87,54.28 80.63,54.28 80.63,71.24 42.41,71.24
  pour Top (isolate 0.305, rank 3, no thermals): 42.41,56.7 45.45,56.7 47.87,54.28 80.63,54.28 80.63,71.24 42.41,71.24
  pour Bottom: 34.33,26.65 15.41,26.65 15.41,15.86 34.33,15.86
  pour Top (rank 6): 58.18,25.96 58.25,32.44 54.34,36.34 40.53,36.34 38.72,34.53 38.72,27.77 46.91,27.77 46.91,23.04 50.63,23.04 50.63,25.93
  pour Top (rank 6, no thermals): 58.15,25.9 55.71,25.87 55.71,28.06 58.21,28.06 58.21,25.9
  pour Top (rank 6, no thermals): 38.69,29.33 41.29,29.33 41.26,25.71 38.69,25.71
  pour Bottom (rank 6, no thermals): 58.18,25.96 58.25,32.44 54.34,36.34 40.53,36.34 38.72,34.53 38.72,25.83 40.88,25.83 40.88,27.3 46.91,27.33 46.91,23.04 50.63,23.04 50.63,25.93
  pour Top (rank 2, no thermals): 59.43,25.67 61.76,25.67 61.76,28.16 59.43,28.16
  pour Bottom (rank 2, no thermals): 59.43,25.67 61.76,25.67 61.76,28.16 59.43,28.16
  pour Bottom (rank 2, no thermals): 77.17,25.2 79.81,25.2 79.81,27.54 77.17,27.54
  pour Top (rank 2, no thermals): 77.17,25.2 79.81,25.2 79.81,27.54 77.17,27.54
  pour Bottom (rank 6, no thermals): 79.97,23.03 79.97,30.18 74.05,36.09 62.07,36.09 59.43,33.45 59.43,23.03
  pour Top (rank 6): 79.97,23.03 79.97,30.18 74.05,36.09 62.07,36.09 59.43,33.45 59.43,23.03
MISO  (1 unrouted)
MOSI  (1 unrouted)
N$1
  Top 0.254: 25%.C R19.1
N$2
  Top 0.254: S1.4 94.28,39.63 R16.2 R3.1
N$3  (1 unrouted)
N$4  (1 unrouted)
N$5  (1 unrouted)
N$6
  Top 0.254: U$1.15 45.08,24.04 44.75,23.71 44.75,21.91 C13.1
  Top 0.61: U$4.1 44.65,15.03 44.65,21.6 C13.1
N$7
  Top 0.254: U$1.2 52.04,24.04 52.37,23.71 52.37,22.86 C15.1
  Top 0.61: U$4.2 55.29,13.48 52.69,16.09 52.69,21.38 C15.1
N$8  (via drill 0.36)  (1 unrouted)
  Top 0.254: U$1.13 44.31,25.34 v43.7,25.34
  Bottom 0.254: v46.58,21.8 44.83,21.8 43.7,22.93 v43.7,25.34
N$9  (via drill 0.36)  (2 unrouted)
  Top 0.254: U$1.12 45.09,25.99 v44.34,25.98
  Bottom 0.254: 50.47,21.8 48.48,21.8 47.45,22.84 45.62,22.84 44.34,24.12 v44.34,25.98
  other vias: 50.55,21.8
N$10
  Top 0.305: U$3.15 66,24.02 65.67,23.69 65.67,22 C20.1
  Top 0.61: C20.1 65.46,15.54 U$5.1
N$11  (via drill 0.36, 0.5)  (3 unrouted)
  Top 0.254: U$1.5 52.11,25.99 52.13,26.01 53.24,26.01 v53.32,26.09 | v56.12,30.5 54.59,30.5 | 54.47,29.49 54.47,31.52
  Bottom 0.254: v53.32,26.09 53.48,26.09 56.12,28.72 v56.12,30.5
N$12
  Top 0.305: 74.24,21.89 C22.1
  Top 0.406: U$3.2 72.46,24.01 73.23,24.01 74.14,23.1 C22.1
  Top 0.61: C22.1 74.14,15.29 U$5.2
N$13
  Top 0.254: U$1.11 46.76,26.64 46.94,26.82 46.94,27.58 46.58,27.94 U$1.9 44.74,27.94 44.21,28.47 44.21,29.41 C10.1
N$14  (via drill 0.36)
  Top 0.254: U$3.13 66.53,25.41 v64.41,25.41 | C20.2 68.61,21.79 v68.76,21.94
  Bottom 0.254: v68.76,21.94 68.76,22.4 68.61,22.56 65.81,22.56 64.41,23.96 v64.41,25.41
N$15  (via drill 0.36)  (1 unrouted)
  Top 0.254: U$1.6 v52.6,26.64 v52.61,26.64
  Bottom 0.254: v46.34,29.74 51.1,29.74 51.42,29.42 51.42,27.84 v52.61,26.64
N$16
  Top 0.813: C11.2 R14.2
N$17  (via drill 0.36)
  Top 0.254: U$1.7 52.78,27.29 v53.24,27.28 | R12.1 v50.15,32.36 R15.2
  Bottom 0.254: v53.24,27.28 53.24,27.6 52.05,28.79 52.05,31.57 51.18,32.36 v50.15,32.36
N$18  (via drill 0.36)  (1 unrouted)
  Top 0.254: U$3.12 66.65,26.07 65.39,26.07 v65.23,26.07
  Bottom 0.254: v72.34,21.79 70.43,21.79 69.16,23.06 66.24,23.06 65.19,24.11 65.19,26.03 v65.23,26.07
N$19  (via drill 0.36)
  Top 0.254: v74.12,25.91 72.51,25.91 U$3.5 | C16.1 72.72,31.27 v72.72,30.36 72.66,30.3 R17.2
  Bottom 0.254: v74.12,25.91 74.75,26.55 74.75,30.11 74.5,30.36 v72.72,30.36
N$20
  Top 0.254: U$3.11 67.59,26.62 67.83,26.87 67.83,27.63 67.55,27.91 U$3.9 66.31,27.92 C18.1
N$21  (via drill 0.36)  (1 unrouted)
  Top 0.254: U$1.4 52.42,25.34 v52.69,25.38 | S1.2 96.82,31.97 97.17,32.31 v98.44,32.31 99.79,32.31 R2.1 | R3.2 97.93,42.03 98.44,41.52 v98.44,35.81
  Bottom 0.254: v52.69,25.38 53.69,25.38 53.83,25.55 58.53,25.55 58.81,25.82 58.81,34.85 60.36,36.41 78.56,36.41 | v98.44,35.81 v98.44,32.31
N$22  (via drill 0.36)  (1 unrouted)
  Top 0.254: U$3.6 73.41,26.62 v73.48,26.55
  Bottom 0.254: v67.39,29.34 70.69,29.34 71.07,28.96 71.07,27.18 71.7,26.55 v73.48,26.55
N$23
  Top 0.813: C19.2 R18.2
N$24  (via drill 0.36)  (1 unrouted)
  Top 0.254: U$3.7 75.35,27.27 v77.32,29.25
  Bottom 0.254: v77.32,29.25 79.81,31.74
N$25  (via drill 0.36)
  Top 0.406: U2.8 64.34,54.38 64.44,54.28 71.42,54.28 71.74,54.6 74.92,54.6 75.23,54.28 75.23,52.28 Q1.2
  other vias: 70.73,50.22 70.69,49.2 70.69,48.22 70.69,47.2 70.69,46.19 75.97,46.31 76.16,47.74 74.73,46.19 73.11,46.15 76.16,49.2
  pour Top (no thermals): 70,45.71 76.57,45.68 76.57,54.12 74.09,54.16 73.46,53.52 73.46,51.17 70,51.17
  pour Bottom (no thermals): 67.39,45.74 76.57,45.68 76.57,46.35 76.57,54.16 74.09,54.16 73.46,53.52 73.46,51.17 67.39,51.2
N$26  (1 unrouted)
N$27
  Top 0.406: U2.2 63.08,61.9 C23.1
N$28  (1 unrouted)
N$29
  Top 0.406: U2.4 58.89,59.83 R23.1
N$30  (1 unrouted)
N$31  (1 unrouted)
N$32
  Top 0.406: U2.7 63.08,56.09 63.46,56.47 66.08,56.47 C24.1
N$33
  Top 0.254: 50%.C R22.1
N$34
  Top 0.254: 75%.C R21.1
N$35
  Top 0.254: 100%.C R24.1
N$36
  Top 0.254: 40.14,49.78 40.14,41.85 42.63,39.36 83.39,39.36
RST
  Top 0.152: R4.1 13.46,42.43 C1.1 13.46,42.47 12.45,42.47 11.36,43.56 6.38,43.56 5.76,42.94 5.76,40.76 5.98,40.53 U$2.1
  Top 0.254: U5.22 13.48,40.27 R4.1
RX0BF  (1 unrouted)
  Top 0.254: 17.38,36.41 U5.28
RX1BF  (1 unrouted)
RX_CAN
  Top 0.305: U6.4 33.95,31.1 33.44,31.6 29.89,31.6 29.38,31.1 29.38,28.05 28.23,26.91 28.23,26.02 28.49,25.76 29.12,25.76 IC1.2
RXINT  (1 unrouted)
SCL  (3 unrouted)
  Top 0.254: U1.12 51.5,61.57 49.01,64.06 39.95,64.06 38.89,63.01 38.89,40.92 42.01,37.8 83.08,37.8 83.23,37.65
SDA  (3 unrouted)
  Top 0.254: U1.13 50.84,61.34 48.63,63.55 40.37,63.55 39.52,62.7 39.52,41.38 42.16,38.74 83.39,38.74
SMBALERT  (1 unrouted)
  Top 0.254: U1.16 48.88,62.41 48.25,63.05 40.8,63.05 40.14,62.39 40.14,49.94 | U5.9 27.78,35.07 29.71,33.14 35.32,33.14
STE  (1 unrouted)
TEST  (via drill 0.36)
  Top 0.152: U$2.6 7.53,37.43 8.71,36.25 10.42,36.25 v11.67,37.49 | v15.56,40.92 17.38,40.92
  Top 0.254: 17.38,40.92 U5.21
  Bottom 0.152: v11.67,37.49 11.67,40.45 12.13,40.92 v15.56,40.92
TRIGGER_CONVERT  (via drill 0.36)  (1 unrouted)
  Top 0.254: U5.5 25.71,32.48 25.98,32.2 35.32,32.2
  Top 0.305: U1.3 50.2,52.33 v50.28,52.25
  Bottom 0.254: 49.39,52.25 49.14,52.25 47.36,50.47 47.36,38.21 48.7,36.87 83.7,36.87 83.86,36.72
  Bottom 0.305: v50.28,52.25 49.39,52.25
TX0RTS  (1 unrouted)
TX1RTS  (1 unrouted)
TX2RTS  (1 unrouted)
TX_CAN
  Top 0.305: U6.1 30.14,26.78 29.76,26.4 IC1.1
UART_RX
  Top 0.152: 7.62,42.47 7.31,42.16 7.31,40.03 U$2.2
  Top 0.254: U5.24 17.31,38.89 12.45,38.89 11.67,39.67 11.67,42.01 10.73,42.94 8.09,42.94 7.62,42.47
UART_TX  (via drill 0.36)
  Top 0.152: U5.23 15.68,39.64 v15.56,39.52 | v5.29,39.36 5.32,39.36 U$2.3
  Bottom 0.152: v15.56,39.52 13.22,39.52 12.76,39.05 12.76,37.34 10.89,35.47 7.31,35.47 6.69,36.09 6.69,39.05 6.38,39.36 v5.29,39.36
VBUS  (via drill 0.36)  (1 unrouted)
  Top 1.524: U$14.4 81.76,54.51 C27.+
  other vias: 77.46,46.35 77.46,48.25 77.46,55.24
  pour Top (isolate 0.254, rank 2, no thermals): 82.54,55.78 76.98,55.78 76.98,45.71 82.54,45.71
  pour Bottom (isolate 0.254, rank 2, no thermals): 82.54,55.78 76.98,55.78 76.98,45.71 82.54,45.71
VBUS_BYPASS  (1 unrouted)
  Top 0.254: U2.5 60.53,53.74 61.27,53.01 71.97,53.01 Q1.1
VBUS_ENABLE  (1 unrouted)
  Top 0.406: C25.1 56.92,61.84 R23.2 56.98,59.84
VCC  (via drill 0.36)  (1 unrouted)
  Top 0.254: S1.3 96.82,34.89 97.48,34.22 99.69,34.22 R2.2
  Top 0.305: U1.2 49.54,52.68 49.52,52.68 49.52,48.44 R1.2 | U2.1 64.34,57.74 63.96,57.36 59.9,57.36 59.39,56.85 59.39,49.25 R25.2
  Top 0.406: U2.1 64.34,63.67 C26.1
  other vias: 55.36,50.6 55.36,49.46 55.36,48.44 55.36,47.42 55.36,46.41 57.01,50.6 57.01,49.46 57.01,48.44 57.01,47.42 57.01,46.41 59.55,50.6 59.55,49.33 59.55,48.38 59.55,47.42 59.55,46.47 52.82,46.09 52.82,47.36 52.82,48.63 52.82,49.58 52.82,50.85 50.28,45.14
  pour Top (no thermals): 52.37,51.43 59.99,51.43 59.99,46.35 60.63,45.71 63.17,45.71 63.17,40 49.83,40 49.83,45.71 51.74,45.71 52.37,46.35
  pour Bottom (no thermals): 52.37,51.43 59.99,51.43 59.99,46.35 60.63,45.71 63.17,45.71 63.17,40 49.83,40 49.83,45.71 51.74,45.71 52.37,46.35
VCC_1  (via drill 0.36)
  Top 0.305: U1.1 48.88,52.76 44.44,48.31 43.85,48.31 R1.1
  other vias: 42.02,50.6 42.02,49.58 42.02,48.57 42.02,47.55 42.02,46.54 45.96,50.47 45.96,49.46 45.96,48.44 45.96,47.42 45.96,46.41
  pour Top (isolate 0.305, no thermals): 42.41,56.31 45.2,56.31 46.6,54.92 46.6,45.01 46.22,44.63 41.26,44.63 40.75,45.14 40.75,54.66
  pour Bottom (isolate 0.305, no thermals): 42.41,56.31 45.2,56.31 46.6,54.92 46.6,45.01 46.22,44.63 41.26,44.63 40.75,45.14 40.75,54.66
VCC_3V  (via drill 0.36)
  other vias: 44.85,27.07 44.97,24.69 42.34,24.56
  pour Top (rank 5, no thermals): 46.4,23.01 38.85,23.01 38.85,25.49 41.26,25.49 41.26,27.42 46.47,27.45
  pour Bottom (rank 5, no thermals): 46.4,23.01 38.85,23.01 38.85,25.49 41.26,25.49 41.26,27.42 46.47,27.45
VCC_ADJ  (via drill 0.36)
  other vias: 65.96,24.74 65.65,27.23 63.94,23.34
  pour Top (no thermals): 67.32,23.06 59.39,23.06 59.43,25.51 61.92,25.51 61.92,28.14 67.32,28.14
  pour Bottom (no thermals): 67.32,23.06 59.39,23.06 59.43,25.51 61.92,25.51 61.92,28.14 67.32,28.14
VCORE
  Top 0.254: 14.58,33.7 14.41,33.7 C2.1 14.49,33.77 U5.32
  Top 0.305: 14.66,33.77 14.58,33.7
XIN
  Top 0.254: IC1.9 27.74,21.2 25.44,18.9 Q2.2 C7.1
XOUT
  Top 0.254: IC1.8 27.7,21.85 25.44,24.11 23.42,24.11 Q2.1 C8.1

### Text on the board
tPlace: INPUT | OUTPUT | INPUT | OUTPUT | 3.3V | ADJ
tNames: Vbus Reg | Vcc